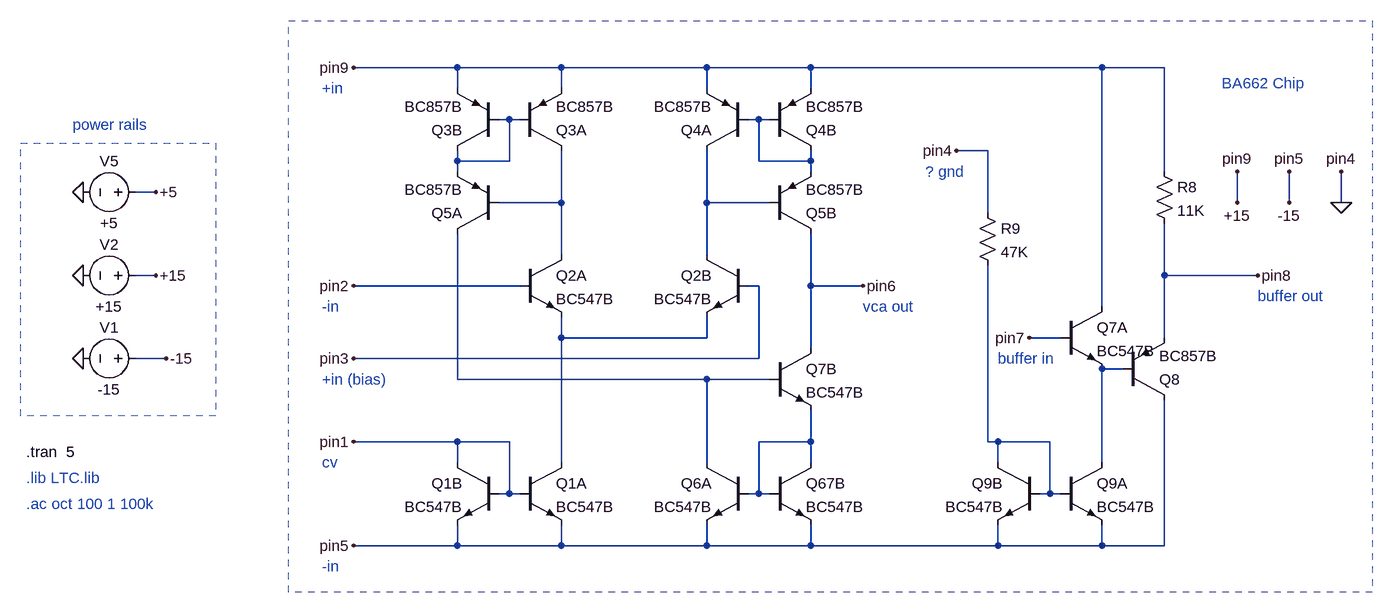
[diagram p0: schematic BA662A .asc]
BA662A .asc, the LTspice schematic file:
Version 4
SHEET 1 3104 2628
WIRE 1376 -208 1216 -208
WIRE 1536 -208 1376 -208
WIRE 1760 -208 1536 -208
WIRE 1920 -208 1760 -208
WIRE 2368 -208 1920 -208
WIRE 2464 -208 2368 -208
WIRE 1376 -176 1376 -208
WIRE 1536 -176 1536 -208
WIRE 1760 -176 1760 -208
WIRE 1920 -176 1920 -208
WIRE 1456 -128 1440 -128
WIRE 1472 -128 1456 -128
WIRE 1840 -128 1824 -128
WIRE 1856 -128 1840 -128
WIRE 2192 -80 2144 -80
WIRE 1376 -64 1376 -80
WIRE 1456 -64 1456 -128
WIRE 1456 -64 1376 -64
WIRE 1840 -64 1840 -128
WIRE 1920 -64 1920 -80
WIRE 1920 -64 1840 -64
WIRE 1376 -48 1376 -64
WIRE 1920 -48 1920 -64
WIRE 2464 -48 2464 -208
WIRE 912 -16 880 -16
WIRE 1536 0 1536 -80
WIRE 1536 0 1440 0
WIRE 1760 0 1760 -80
WIRE 1856 0 1760 0
WIRE 2576 0 2576 -48
WIRE 2656 0 2656 -48
WIRE 2736 0 2736 -48
WIRE 2192 16 2192 -80
WIRE 1536 80 1536 0
WIRE 1760 80 1760 0
WIRE 912 112 880 112
WIRE 2464 112 2464 32
WIRE 2608 112 2464 112
WIRE 1472 128 1216 128
WIRE 1840 128 1824 128
WIRE 1920 128 1920 48
WIRE 2000 128 1920 128
WIRE 2368 160 2368 -208
WIRE 1536 208 1536 176
WIRE 1760 208 1760 176
WIRE 1760 208 1536 208
WIRE 2304 208 2256 208
WIRE 2464 208 2464 112
WIRE 1920 224 1920 128
WIRE 928 240 880 240
WIRE 1840 240 1840 128
WIRE 1840 240 1216 240
WIRE 2400 256 2368 256
WIRE 1376 272 1376 48
WIRE 1760 272 1376 272
WIRE 1856 272 1760 272
WIRE 1376 368 1216 368
WIRE 1456 368 1376 368
WIRE 1920 368 1920 320
WIRE 1920 368 1840 368
WIRE 2192 368 2192 96
WIRE 2208 368 2192 368
WIRE 2288 368 2208 368
WIRE 1376 400 1376 368
WIRE 1536 400 1536 208
WIRE 1760 400 1760 272
WIRE 1920 400 1920 368
WIRE 2208 400 2208 368
WIRE 2368 400 2368 256
WIRE 1456 448 1456 368
WIRE 1456 448 1440 448
WIRE 1472 448 1456 448
WIRE 1840 448 1840 368
WIRE 1840 448 1824 448
WIRE 1856 448 1840 448
WIRE 2288 448 2288 368
WIRE 2288 448 2272 448
WIRE 2304 448 2288 448
WIRE 1376 528 1376 496
WIRE 1376 528 1216 528
WIRE 1536 528 1536 496
WIRE 1536 528 1376 528
WIRE 1760 528 1760 496
WIRE 1760 528 1536 528
WIRE 1920 528 1920 496
WIRE 1920 528 1760 528
WIRE 2208 528 2208 496
WIRE 2208 528 1920 528
WIRE 2368 528 2368 496
WIRE 2368 528 2208 528
WIRE 2464 528 2464 304
WIRE 2464 528 2368 528
FLAG 800 240 0
FLAG 800 112 0
FLAG 912 112 +15
FLAG 928 240 -15
FLAG 1216 -208 pin9
FLAG 2608 112 pin8
FLAG 2256 208 pin7
FLAG 2000 128 pin6
FLAG 1216 528 pin5
FLAG 1216 240 pin3
FLAG 1216 128 pin2
FLAG 1216 368 pin1
FLAG 2144 -80 pin4
FLAG 2576 -48 pin9
FLAG 2656 -48 pin5
FLAG 2736 -48 pin4
FLAG 2576 0 +15
FLAG 2656 0 -15
FLAG 2736 0 0
FLAG 800 -16 0
FLAG 912 -16 +5
SYMBOL voltage 896 240 M270
WINDOW 0 32 56 VTop 2
WINDOW 3 -32 56 VBottom 2
SYMATTR InstName V1
SYMATTR Value -15
SYMATTR Value2 AC 1
SYMBOL voltage 896 112 M270
WINDOW 0 32 56 VTop 2
WINDOW 3 -32 56 VBottom 2
SYMATTR InstName V2
SYMATTR Value +15
SYMATTR Value2 AC 1
SYMBOL npn 1472 80 R0
SYMATTR InstName Q2A
SYMATTR Value BC547B
SYMBOL pnp 1440 -80 R180
SYMATTR InstName Q3B
SYMATTR Value BC857B
SYMBOL pnp 1472 -80 M180
SYMATTR InstName Q3A
SYMATTR Value BC857B
SYMBOL pnp 1440 48 R180
SYMATTR InstName Q5A
SYMATTR Value BC857B
SYMBOL npn 1472 400 R0
SYMATTR InstName Q1A
SYMATTR Value BC547B
SYMBOL npn 1440 400 M0
SYMATTR InstName Q1B
SYMATTR Value BC547B
SYMBOL npn 1824 80 M0
SYMATTR InstName Q2B
SYMATTR Value BC547B
SYMBOL pnp 1856 -80 M180
SYMATTR InstName Q4B
SYMATTR Value BC857B
SYMBOL pnp 1824 -80 R180
SYMATTR InstName Q4A
SYMATTR Value BC857B
SYMBOL pnp 1856 48 M180
SYMATTR InstName Q5B
SYMATTR Value BC857B
SYMBOL npn 1824 400 M0
SYMATTR InstName Q6A
SYMATTR Value BC547B
SYMBOL npn 1856 400 R0
SYMATTR InstName Q67B
SYMATTR Value BC547B
SYMBOL npn 1856 224 R0
SYMATTR InstName Q7B
SYMATTR Value BC547B
SYMBOL npn 2272 400 M0
SYMATTR InstName Q9B
SYMATTR Value BC547B
SYMBOL npn 2304 400 R0
SYMATTR InstName Q9A
SYMATTR Value BC547B
SYMBOL pnp 2400 304 M180
SYMATTR InstName Q8
SYMATTR Value BC857B
SYMBOL npn 2304 160 R0
SYMATTR InstName Q7A
SYMATTR Value BC547B
SYMBOL res 2448 -64 R0
SYMATTR InstName R8
SYMATTR Value 11K
SYMBOL res 2176 0 R0
SYMATTR InstName R9
SYMATTR Value 47K
SYMBOL voltage 896 -16 M270
WINDOW 0 32 56 VTop 2
WINDOW 3 -32 56 VBottom 2
SYMATTR InstName V5
SYMATTR Value +5
SYMATTR Value2 AC 1
TEXT 712 384 Left 2 !.tran  5
TEXT 712 464 Left 2 ;.ac oct 100 1 100k
TEXT 712 424 Left 2 ;.lib LTC.lib
TEXT 1168 400 Left 2 ;cv
TEXT 1168 272 Left 2 ;+in (bias)
TEXT 1168 160 Left 2 ;-in
TEXT 1168 -176 Left 2 ;+in
TEXT 1168 560 Left 2 ;-in
TEXT 2000 160 Left 2 ;vca out
TEXT 2096 -48 Left 2 ;? gnd
TEXT 2208 240 Left 2 ;buffer in
TEXT 2608 144 Left 2 ;buffer out
TEXT 2552 -184 Left 2 ;BA662 Chip
TEXT 784 -120 Left 2 ;power rails
RECTANGLE Normal 1116 -280 2784 600 2
RECTANGLE Normal 704 -92 1004 328 2

The netlist it stands for:
* BA662A .asc
V1 pin5 0 -15 AC 1
V2 pin9 0 +15 AC 1
Q2A N003 pin2 N005 0 BC547B
Q3B N001 N001 pin9 0 BC857B
Q3A N003 N001 pin9 0 BC857B
Q5A N007 N003 N001 0 BC857B
Q1A N005 pin1 pin5 0 BC547B
Q1B pin1 pin1 pin5 0 BC547B
Q2B N004 pin3 N005 0 BC547B
Q4B N002 N002 pin9 0 BC857B
Q4A N004 N002 pin9 0 BC857B
Q5B pin6 N004 N002 0 BC857B
Q6A N007 N008 pin5 0 BC547B
Q67B N008 N008 pin5 0 BC547B
Q7B pin6 N007 N008 0 BC547B
Q9B N009 N009 pin5 0 BC547B
Q9A N006 N009 pin5 0 BC547B
Q8 pin5 N006 pin8 0 BC857B
Q7A pin9 pin7 N006 0 BC547B
R8 pin9 pin8 11K
R9 0 N009 47K
V5 +5 0 +5 AC 1
.model NPN NPN
.model PNP PNP
.lib standard.bjt
.tran  5
* .ac oct 100 1 100k
* .lib LTC.lib
* cv
* +in (bias)
* -in
* +in
* -in
* vca out
* ? gnd
* buffer in
* buffer out
* BA662 Chip
* power rails
.backanno
.end